# Altium schematic sheet US_shield.SchDoc
size A4; Date: 09 July 2012; Author: Simon Markham; DrawnBy: Simon Markham; Engineer: Simon Markham; Organization: Markham Designs
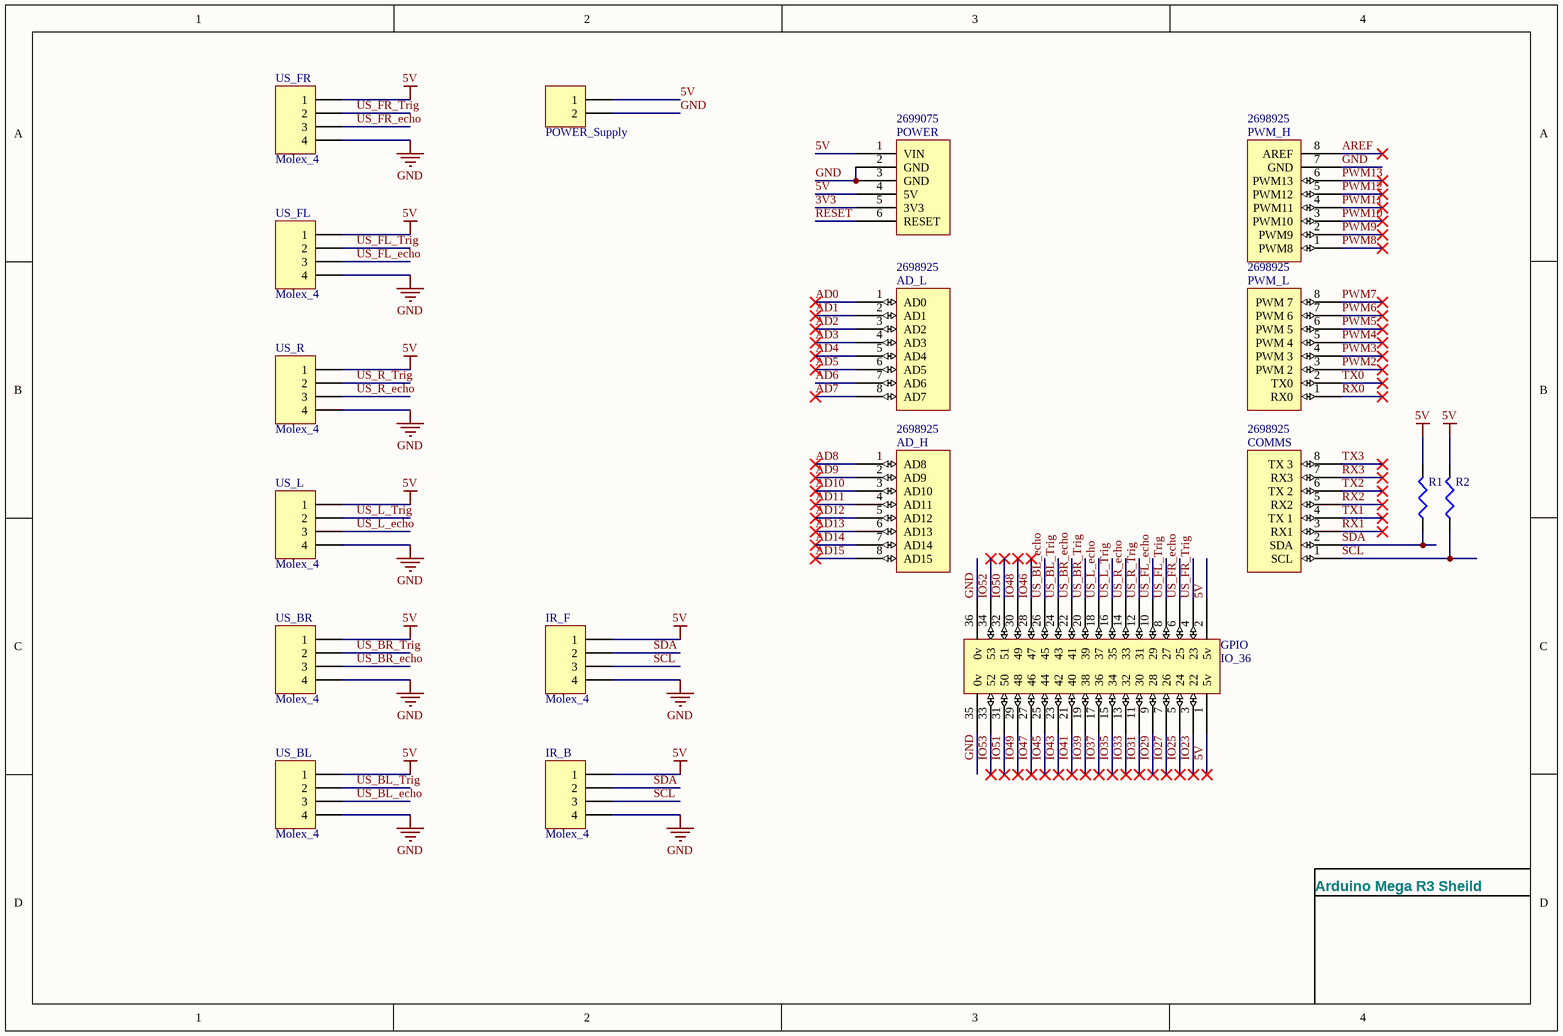
[diagram p0: US_shield.SchDoc]

## Parts
AD_H  Supplier Part Number 4: 2698925  [Header 8x1 8.5mm]  (hidden comment: AD_H)
AD_L  Supplier Part Number 5: 2698925  [Header 8x1 8.5mm]  (hidden comment: AD_L)
COMMS  Supplier Part Number 4: 2698925  [Header 8x1 8.5mm]  (hidden comment: Communication)
GPIO  IO_36  [HEADER 36X 8MM]
IR_B  Molex_4  [Header4_ecam]
IR_F  Molex_4  [Header4_ecam]
POWER  Supplier Part Number 2: 2699075  [Header 6x1 8.5mm]  (hidden comment: POWER)
POWER_Supply  Molex_2  [Header_2Ecam]  (value not drawn)
PWM_H  Supplier Part Number 4: 2698925  [Header 8x1 8.5mm]  (hidden comment: PWM_H)
PWM_L  Supplier Part Number 4: 2698925  [Header 8x1 8.5mm]  (hidden comment: PWM_L)
R1  Résistance  [AXIAL-0.4]  (value not drawn)
R2  Résistance  [AXIAL-0.4]  (value not drawn)
US_BL  Molex_4  [Header4_ecam]
US_BR  Molex_4  [Header4_ecam]
US_FL  Molex_4  [Header4_ecam]
US_FR  Molex_4  [Header4_ecam]
US_L  Molex_4  [Header4_ecam]
US_R  Molex_4  [Header4_ecam]

## Nets
5V: GPIO.1(5v) GPIO.2(5v) IR_B.1 IR_F.1 POWER.1(VIN) POWER.4(5V) POWER_Supply.1 R1.2 R2.2 US_BL.1 US_BR.1 US_FL.1 US_FR.1 US_L.1 US_R.1
GND: GPIO.35(0v) GPIO.36(0v) IR_B.4 IR_F.4 POWER.2(GND) POWER.3(GND) POWER_Supply.2 PWM_H.7(GND) US_BL.4 US_BR.4 US_FL.4 US_FR.4 US_L.4 US_R.4
3V3: POWER.5(3V3)
AD0: AD_L.1(AD0)
AD1: AD_L.2(AD1)
AD2: AD_L.3(AD2)
AD3: AD_L.4(AD3)
AD4: AD_L.5(AD4)
AD5: AD_L.6(AD5)
AD6: AD_L.7(AD6)
AD7: AD_L.8(AD7)
AD8: AD_H.1(AD8)
AD9: AD_H.2(AD9)
AD10: AD_H.3(AD10)
AD11: AD_H.4(AD11)
AD12: AD_H.5(AD12)
AD13: AD_H.6(AD13)
AD14: AD_H.7(AD14)
AD15: AD_H.8(AD15)
AREF: PWM_H.8(AREF)
IO23: GPIO.3(22)
IO25: GPIO.5(24)
IO27: GPIO.7(26)
IO29: GPIO.9(28)
IO31: GPIO.11(30)
IO33: GPIO.13(32)
IO35: GPIO.15(34)
IO37: GPIO.17(36)
IO39: GPIO.19(38)
IO41: GPIO.21(40)
IO43: GPIO.23(42)
IO45: GPIO.25(44)
IO46: GPIO.28(47)
IO47: GPIO.27(46)
IO48: GPIO.30(49)
IO49: GPIO.29(48)
IO50: GPIO.32(51)
IO51: GPIO.31(50)
IO52: GPIO.34(53)
IO53: GPIO.33(52)
PWM2: PWM_L.3(PWM_2)
PWM3: PWM_L.4(PWM_3)
PWM4: PWM_L.5(PWM_4)
PWM5: PWM_L.6(PWM_5)
PWM6: PWM_L.7(PWM_6)
PWM7: PWM_L.8(PWM_7)
PWM8: PWM_H.1(PWM8)
PWM9: PWM_H.2(PWM9)
PWM10: PWM_H.3(PWM10)
PWM11: PWM_H.4(PWM11)
PWM12: PWM_H.5(PWM12)
PWM13: PWM_H.6(PWM13)
RESET: POWER.6(RESET)
RX0: PWM_L.1(RX0)
RX1: COMMS.3(RX1)
RX2: COMMS.5(RX2)
RX3: COMMS.7(RX3)
SCL: COMMS.1(SCL) IR_B.3 IR_F.3 R2.1
SDA: COMMS.2(SDA) IR_B.2 IR_F.2 R1.1
TX0: PWM_L.2(TX0)
TX1: COMMS.4(TX_1)
TX2: COMMS.6(TX_2)
TX3: COMMS.8(TX_3)
US_BL_echo: GPIO.26(45) US_BL.3
US_BL_Trig: GPIO.24(43) US_BL.2
US_BR_echo: GPIO.22(41) US_BR.3
US_BR_Trig: GPIO.20(39) US_BR.2
US_FL_echo: GPIO.10(29) US_FL.3
US_FL_Trig: GPIO.8(27) US_FL.2
US_FR_echo: GPIO.6(25) US_FR.3
US_FR_Trig: GPIO.4(23) US_FR.2
US_L_echo: GPIO.18(37) US_L.3
US_L_Trig: GPIO.16(35) US_L.2
US_R_echo: GPIO.14(33) US_R.3
US_R_Trig: GPIO.12(31) US_R.2

## Notes on the sheet
- Arduino Mega R3 Sheild

## Library data of the parts
GPIO = IO_36: Header, 36-Pin; Supplier: RS 180-0956
IR_B IR_F US_BL US_BR US_FL US_FR US_L US_R = Molex_4: Header, 4-Pin; LatestRevisionDate: 17-Jul-2002; LatestRevisionNote: Re-released for DXP Platform.; Publisher: Altium Limited; Supplier: Farnell 9731164
POWER_Supply = Molex_2: Header, 2-pin; Designer: ECAM 2005; Supplier: ECAM; Type: Connecteur à vis
R1 R2 = Résistance: Résistance standard; Designer: ECAM 2005; Type: Résistance standard
AD_H = AD_H: Supplier 1: Arrow; Supplier Part Number 1: 2698940; Supplier 2: Arrow; Supplier Part Number 2: 2698939; Supplier 3: Digi-Key; Supplier Part Number 3: SAM1198-08-ND; Supplier 4: Arrow
AD_L = AD_L: Supplier 1: Digi-Key; Supplier Part Number 1: SAM1198-08-ND; Supplier 2: Arrow; Supplier Part Number 2: 2698939; Supplier 3: Arrow; Supplier Part Number 3: 2698940; Supplier 4: Arrow; Supplier Part Number 4: 43085273; Supplier 5: Arrow
COMMS = Communication: Supplier 1: Digi-Key; Supplier Part Number 1: SAM1198-08-ND; Supplier 2: Arrow; Supplier Part Number 2: 2698940; Supplier 3: Arrow; Supplier Part Number 3: 2698939; Supplier 4: Arrow
POWER = POWER: Supplier 1: Arrow; Supplier Part Number 1: 52553843; Supplier 2: Arrow; Supplier 3: Digi-Key; Supplier Part Number 3: SAM1198-06-ND; Supplier 4: Arrow; Supplier Part Number 4: 2699089; Supplier 5: Arrow; Supplier Part Number 5: 2699088
PWM_H = PWM_H: Supplier 1: Digi-Key; Supplier Part Number 1: SAM1198-08-ND; Supplier 2: Arrow; Supplier Part Number 2: 2698940; Supplier 3: Arrow; Supplier Part Number 3: 2698939; Supplier 4: Arrow
PWM_L = PWM_L: Supplier 1: Arrow; Supplier Part Number 1: 2698940; Supplier 2: Arrow; Supplier Part Number 2: 2698939; Supplier 3: Digi-Key; Supplier Part Number 3: SAM1198-08-ND; Supplier 4: Arrow